# Altium schematic sheet Underwater_ROV_CurrentSense.SchDoc
size A
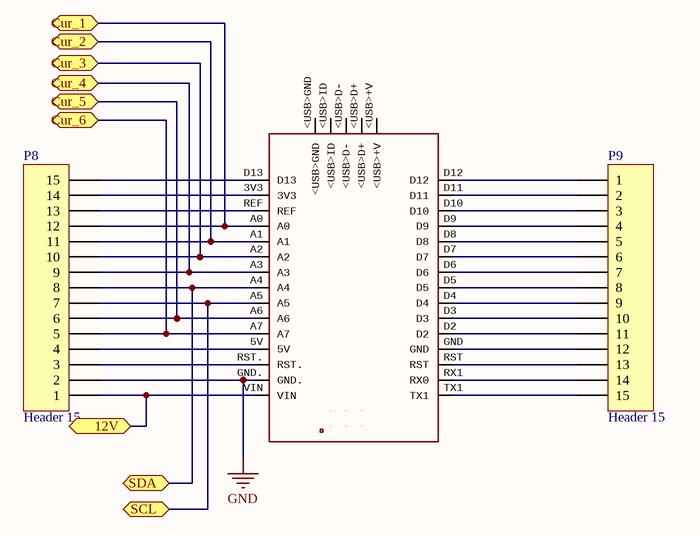
[diagram p0: Underwater_ROV_CurrentSense.SchDoc]

## Parts
Nano_Cur1  Device for representing an Arduino Nano board with a footprint in an EAGLE design. Created by Dave Young for Element14. More EAGLE documentation at: http://www.element14.com/community/community/knode/cadsoft_eagle  [ARDUINO_NANO]  (value not drawn)
P8  Header 15  [HDR1X15]
P9  Header 15  [HDR1X15]

## Ports
12V, Cur_1, Cur_2, Cur_3, Cur_4, Cur_5, Cur_6, SCL, SDA

## Nets
GND: Nano_Cur1.GND. P8.2
12V: Nano_Cur1.VIN P8.1 ; port 12V
Cur_1: Nano_Cur1.A0 P8.12 ; port Cur_1
Cur_2: Nano_Cur1.A1 P8.11 ; port Cur_2
Cur_3: Nano_Cur1.A2 P8.10 ; port Cur_3
Cur_4: Nano_Cur1.A3 P8.9 ; port Cur_4
Cur_5: Nano_Cur1.A6 P8.6 ; port Cur_5
Cur_6: Nano_Cur1.A7 P8.5 ; port Cur_6
SCL: Nano_Cur1.A5 P8.7 ; port SCL
SDA: Nano_Cur1.A4 P8.8 ; port SDA
NetNano_Cur1_3V3: Nano_Cur1.3V3 P8.14
NetNano_Cur1_5V: Nano_Cur1.5V P8.4
NetNano_Cur1_D2: Nano_Cur1.D2 P9.11
NetNano_Cur1_D3: Nano_Cur1.D3 P9.10
NetNano_Cur1_D4: Nano_Cur1.D4 P9.9
NetNano_Cur1_D5: Nano_Cur1.D5 P9.8
NetNano_Cur1_D6: Nano_Cur1.D6 P9.7
NetNano_Cur1_D7: Nano_Cur1.D7 P9.6
NetNano_Cur1_D8: Nano_Cur1.D8 P9.5
NetNano_Cur1_D9: Nano_Cur1.D9 P9.4
NetNano_Cur1_D10: Nano_Cur1.D10 P9.3
NetNano_Cur1_D11: Nano_Cur1.D11 P9.2
NetNano_Cur1_D12: Nano_Cur1.D12 P9.1
NetNano_Cur1_D13: Nano_Cur1.D13 P8.15
NetNano_Cur1_GND: Nano_Cur1.GND P9.12
NetNano_Cur1_REF: Nano_Cur1.REF P8.13
NetNano_Cur1_RST: Nano_Cur1.RST P9.13
NetNano_Cur1_RST.: Nano_Cur1.RST. P8.3
NetNano_Cur1_RX1: Nano_Cur1.RX1(RX0) P9.14
NetNano_Cur1_TX1: Nano_Cur1.TX1 P9.15

Not connected (* = marked no-connect by the designer): Nano_Cur1 5V. <USB>+V <USB>D+ <USB>D- <USB>GND <USB>ID GND_ MISO MOSI RESET.. SCK

## Library data of the parts
Nano_Cur1 = ARDUINO_NANO
P8 P9 = Header 15: Header, 15-Pin; LatestRevisionDate: 17-Jul-2002; LatestRevisionNote: Re-released for DXP Platform.; Publisher: Altium Limited